# Altium schematic sheet Імпульсний ліхтарик.SchDoc
size A4; SheetNumber: 1; SheetTotal: 1
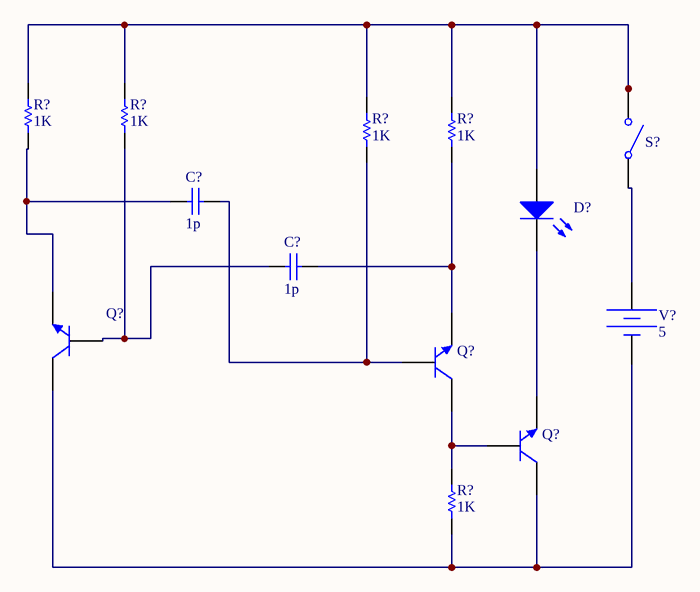
[diagram p0: Імпульсний ліхтарик.SchDoc]

## Parts
(Parts that share a designator on the sheet are numbered #1, #2 ... from top to bottom, then left to right.)
C?#1  value 1p  (hidden comment: Capacitor)
C?#2  value 1p  (hidden comment: Capacitor)
D?  Light-Emitting Diode  (value not drawn)
Q?#1  Bipolar  NPN 3 Pins  Transistor   Gummel-Poon Model  (value not drawn)
Q?#2  Bipolar  NPN 3 Pins  Transistor   Gummel-Poon Model  (value not drawn)
Q?#3  Bipolar  NPN 3 Pins  Transistor   Gummel-Poon Model  (value not drawn)
R?#1  value 1K  (hidden comment: Resistor)
R?#2  value 1K  (hidden comment: Resistor)
R?#3  value 1K  (hidden comment: Resistor)
R?#4  value 1K  (hidden comment: Resistor)
R?#5  value 1K  (hidden comment: Resistor)
S?  Single-Pole,Single-Throw Switch  (value not drawn)
V?  DC Magnitude: 5  (hidden comment: Constant Voltage Source)

## Nets
NetC?#1_1: C?#1.1 Q?#1.3(E) R?#1.1
NetC?#1_2: C?#1.2 Q?#2.2(B) R?#3.1
NetC?#2_1: C?#2.1 Q?#1.2(B) R?#2.1
NetC?#2_2: C?#2.2 Q?#2.3(E) R?#4.1
NetD?_1: D?.1(A) R?#1.2 R?#2.2 R?#3.2 R?#4.2 S?.2
NetD?_2: D?.2(K) Q?#3.3(E)
NetQ?#1_1: Q?#1.1(C) Q?#3.1(C) R?#5.1 V?.2
NetQ?#2_1: Q?#2.1(C) Q?#3.2(B) R?#5.2
NetS?_1: S?.1 V?.1

## Library data of the parts
C?#1 C?#2 = Capacitor: SimulationGenericComponent: True
D? = LED: AF: 1; BV: 0; BV_MAX: 1e99; EG: 1.11; FC: 0.5; IBV: 0.001; IS: 1e-14; MJSW: 0.33; NTUN: 30; TNOM: 27; XTI: 3; SimulationGenericComponent: True; CJO: 0; CJP: 0; CTA: 0; CTP: 0; FCS: 0.5; FV_MAX: 1e99; IKF: 0; IKR: 0; ISR: 1e-14; JSW: 0; JTUN: 0; JTUNSW: 0; KEG: 1; KF: 0; LEVEL: 1; N: 1; NBV: 1; NR: 1; NS: 1; PHP: 1; RS: 0; TCV: 0; TLEV: 0; TLEVC: 0; TM1: 0; TM2: 0; TPB: 0; TPHP: 0; TRS: 0; TRS2: 0; TT: 0; TTT1: 0; TTT2: 0; VJ: 1; XTITUN: 3
Q?#1-Q?#3 = BJT NPN_GP: SimulationGenericComponent: True; BF: 100; AF: 0; BR: 1; EG: 1.11; FC: 0.5; IS: 1e-16; MJC: 0.33; NC: 2; NE: 1.5; TNOM: 27; VBC_MAX: 1e99; VJC: 0.75; XTI: 3; CJC: 0; CJE: 0; CJS: 0; CTC: 0; CTE: 0; CTS: 0; IKF: 0; IKR: 0; IRB: 0; ISC: 0; ISE: 0; ISS: 0; ITF: 0; KF: 0; MJE: 0.33; MJS: 0; NF: 1; NKF: 0.5; NR: 1; NS: 1; PTF: 0; RB: 0; RBM: 0; RC: 0; RE: 0; SUBS: 1; TBF1: 0; TBF2: 0; TBR1: 0; TBR2: 0; TF: 0; TIKF1: 0; TIKF2: 0; TIKR1: 0; TIKR2: 0; TIRB1: 0; TIRB2: 0; TIS1: 0; TIS2: 0; TISC1: 0; TISC2: 0; TISE1: 0; TISE2: 0; TITF1: 0; TITF2: 0; TLEV: 0; TLEVC: 0; TMJC1: 0; TMJC2: 0; TMJE1: 0; TMJE2: 0; TMJS1: 0; TMJS2: 0; TNC1: 0; TNC2: 0; TNE1: 0; TNE2: 0; TNF1: 0; TNF2: 0; TNR1: 0; TNR2: 0; TNS1: 0; TNS2: 0; TR: 0; TRB1: 0; TRB2: 0; TRC1: 0; TRC2: 0; TRE1: 0; TRE2: 0; TRM1: 0; TRM2: 0; TTF1: 0; TTF2: 0; TTR1: 0; TTR2: 0; TVAF1: 0; TVAF2: 0; TVAR1: 0; TVAR2: 0; TVJC: 0; TVJE: 0; TVJS: 0; VAF: 0; VAR: 0; VBE_MAX: 1e99; VCE_MAX: 1e99; VJE: 0.75; VJS: 0.75; VTF: 0; XCJC: 1; XTB: 0; XTF: 0
R?#1-R?#5 = Resistor: TC1: 0; SimulationGenericComponent: True; TC2: 0
S? = SPST SW: closed: 0; Rclosed: 1m; Ropen: 1Meg; SimulationGenericComponent: True
V? = Battery: SimulationGenericComponent: True